# EAGLE design tick-wifi-mk-0.9 (EAGLE 7.5.0)
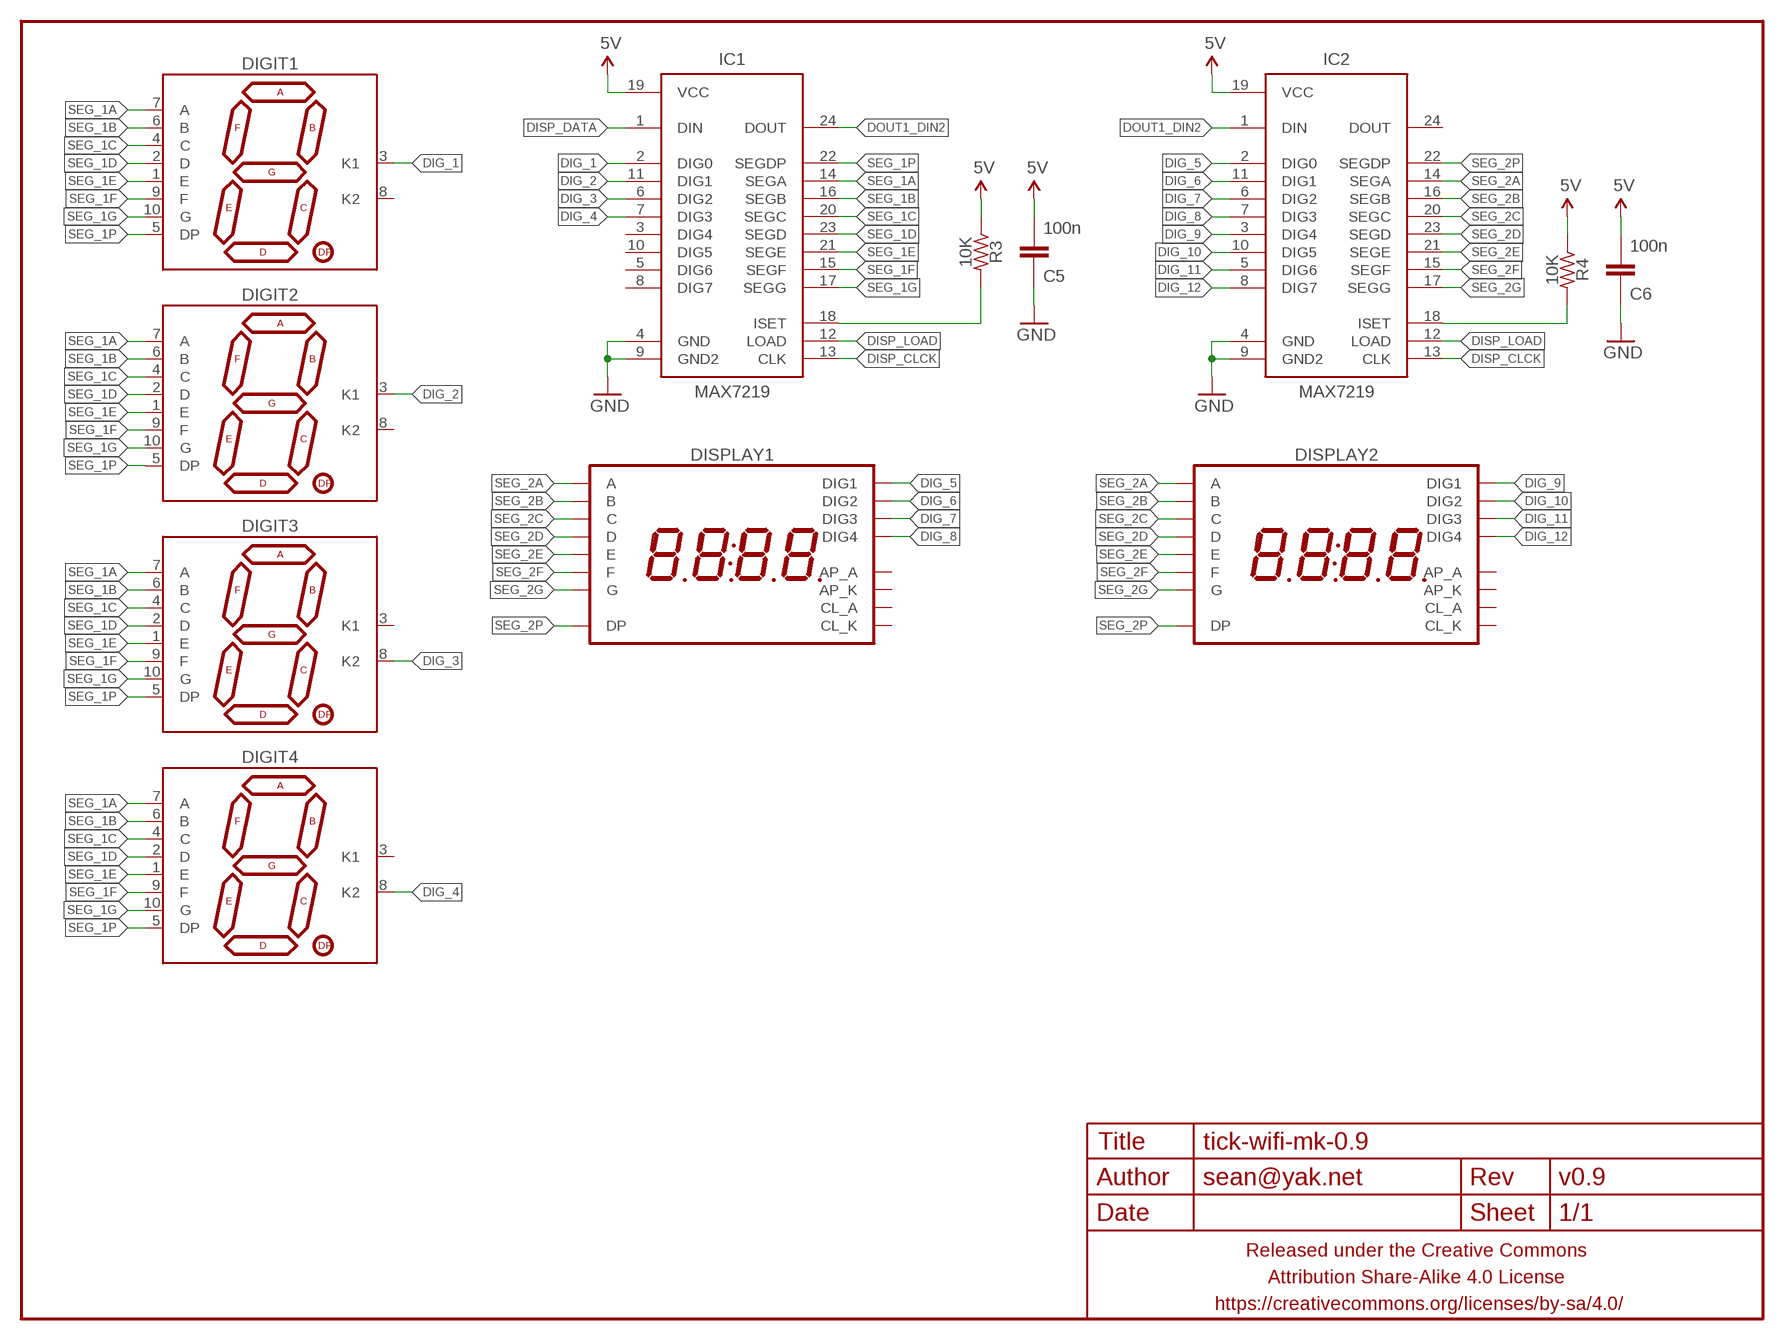
[diagram p0: schematic, sheet 1]

## Parts
C5  100n  CAPACITOR-CERAMICC0603  [C0603]
C6  100n  CAPACITOR-CERAMICC0603  [C0603]
DIGIT1  7SEG_1DIGPTH-25.4MM-BARE  [7SEG_1DIG_25.4MM_NOSILK]
DIGIT2  7SEG_1DIGPTH-25.4MM-BARE  [7SEG_1DIG_25.4MM_NOSILK]
DIGIT3  7SEG_1DIGPTH-25.4MM-BARE  [7SEG_1DIG_25.4MM_NOSILK]
DIGIT4  7SEG_1DIGPTH-25.4MM-BARE  [7SEG_1DIG_25.4MM_NOSILK]
DISPLAY1  7SEG_4DIGIT_COLON_APOS  [7SEG_4DIG_10MM]
DISPLAY2  7SEG_4DIGIT_COLON_APOS  [7SEG_4DIG_10MM]
FRAME1  FRAME-LETTERNO_PACKAGE  [DUMMY]
IC1  MAX7219  MAX7219SOIC-W  [SO24W]
IC2  MAX7219  MAX7219SOIC-W  [SO24W]
R3  10K  RESISTORR0603  [R0603]
R4  10K  RESISTORR0603  [R0603]

## Nets
5V: C5.2 C6.2 IC1.19(VCC) IC2.19(VCC) R3.1 R4.1
DIG_1: DIGIT1.3(K1) IC1.2(DIG0)
DIG_2: DIGIT2.3(K1) IC1.11(DIG1)
DIG_3: DIGIT3.8(K2) IC1.6(DIG2)
DIG_4: DIGIT4.8(K2) IC1.7(DIG3)
DIG_5: DISPLAY1.1(DIG1) IC2.2(DIG0)
DIG_6: DISPLAY1.2(DIG2) IC2.11(DIG1)
DIG_7: DISPLAY1.6(DIG3) IC2.6(DIG2)
DIG_8: DISPLAY1.8(DIG4) IC2.7(DIG3)
DIG_9: DISPLAY2.1(DIG1) IC2.3(DIG4)
DIG_10: DISPLAY2.2(DIG2) IC2.10(DIG5)
DIG_11: DISPLAY2.6(DIG3) IC2.5(DIG6)
DIG_12: DISPLAY2.8(DIG4) IC2.8(DIG7)
DISP_CLCK: IC1.13(CLK) IC2.13(CLK)
DISP_DATA: IC1.1(DIN)
DISP_LOAD: IC1.12(LOAD) IC2.12(LOAD)
DOUT1_DIN2: IC1.24(DOUT) IC2.1(DIN)
GND: C5.1 C6.1 IC1.4(GND) IC1.9(GND2) IC2.4(GND) IC2.9(GND2)
N$2: IC2.18(ISET) R4.2
N$4: IC1.18(ISET) R3.2
SEG_1A: DIGIT1.7(A) DIGIT2.7(A) DIGIT3.7(A) DIGIT4.7(A) IC1.14(SEGA)
SEG_1B: DIGIT1.6(B) DIGIT2.6(B) DIGIT3.6(B) DIGIT4.6(B) IC1.16(SEGB)
SEG_1C: DIGIT1.4(C) DIGIT2.4(C) DIGIT3.4(C) DIGIT4.4(C) IC1.20(SEGC)
SEG_1D: DIGIT1.2(D) DIGIT2.2(D) DIGIT3.2(D) DIGIT4.2(D) IC1.23(SEGD)
SEG_1E: DIGIT1.1(E) DIGIT2.1(E) DIGIT3.1(E) DIGIT4.1(E) IC1.21(SEGE)
SEG_1F: DIGIT1.9(F) DIGIT2.9(F) DIGIT3.9(F) DIGIT4.9(F) IC1.15(SEGF)
SEG_1G: DIGIT1.10(G) DIGIT2.10(G) DIGIT3.10(G) DIGIT4.10(G) IC1.17(SEGG)
SEG_1P: DIGIT1.5(DP) DIGIT2.5(DP) DIGIT3.5(DP) DIGIT4.5(DP) IC1.22(SEGDP)
SEG_2A: DISPLAY1.14(A) DISPLAY2.14(A) IC2.14(SEGA)
SEG_2B: DISPLAY1.16(B) DISPLAY2.16(B) IC2.16(SEGB)
SEG_2C: DISPLAY1.13(C) DISPLAY2.13(C) IC2.20(SEGC)
SEG_2D: DISPLAY1.3(D) DISPLAY2.3(D) IC2.23(SEGD)
SEG_2E: DISPLAY1.5(E) DISPLAY2.5(E) IC2.21(SEGE)
SEG_2F: DISPLAY1.11(F) DISPLAY2.11(F) IC2.15(SEGF)
SEG_2G: DISPLAY1.15(G) DISPLAY2.15(G) IC2.17(SEGG)
SEG_2P: DISPLAY1.7(DP) DISPLAY2.7(DP) IC2.22(SEGDP)
Unconnected: DIGIT1.8(K2) DIGIT2.8(K2) DIGIT3.3(K1) DIGIT4.3(K1) DISPLAY1.4(CL_A) DISPLAY1.9(AP_K) DISPLAY1.10(AP_A) DISPLAY1.12(CL_K) DISPLAY2.4(CL_A) DISPLAY2.9(AP_K) DISPLAY2.10(AP_A) DISPLAY2.12(CL_K) IC1.3(DIG4) IC1.5(DIG6) IC1.8(DIG7) IC1.10(DIG5) IC2.24(DOUT)

## Library data of the parts
C5 C6 = a_parts:CAPACITOR-CERAMIC: CAPACITOR, European symbol
DIGIT1-DIGIT4 = a_parts:7SEG_1DIG
DISPLAY1 DISPLAY2 = a_parts:7SEG_4DIGIT_COLON_APOS
FRAME1 = a_parts:FRAME-LETTER: Schematic Frame Standard 8.5x11 US Letter frame; DESIGNER: sean@yak.net; VERSION: v0.9
IC1 IC2 = a_parts:MAX7219: 8-digit, 8-segment LED display driver, serial input
R3 R4 = a_parts:RESISTOR: RESISTOR, American symbol

## Board
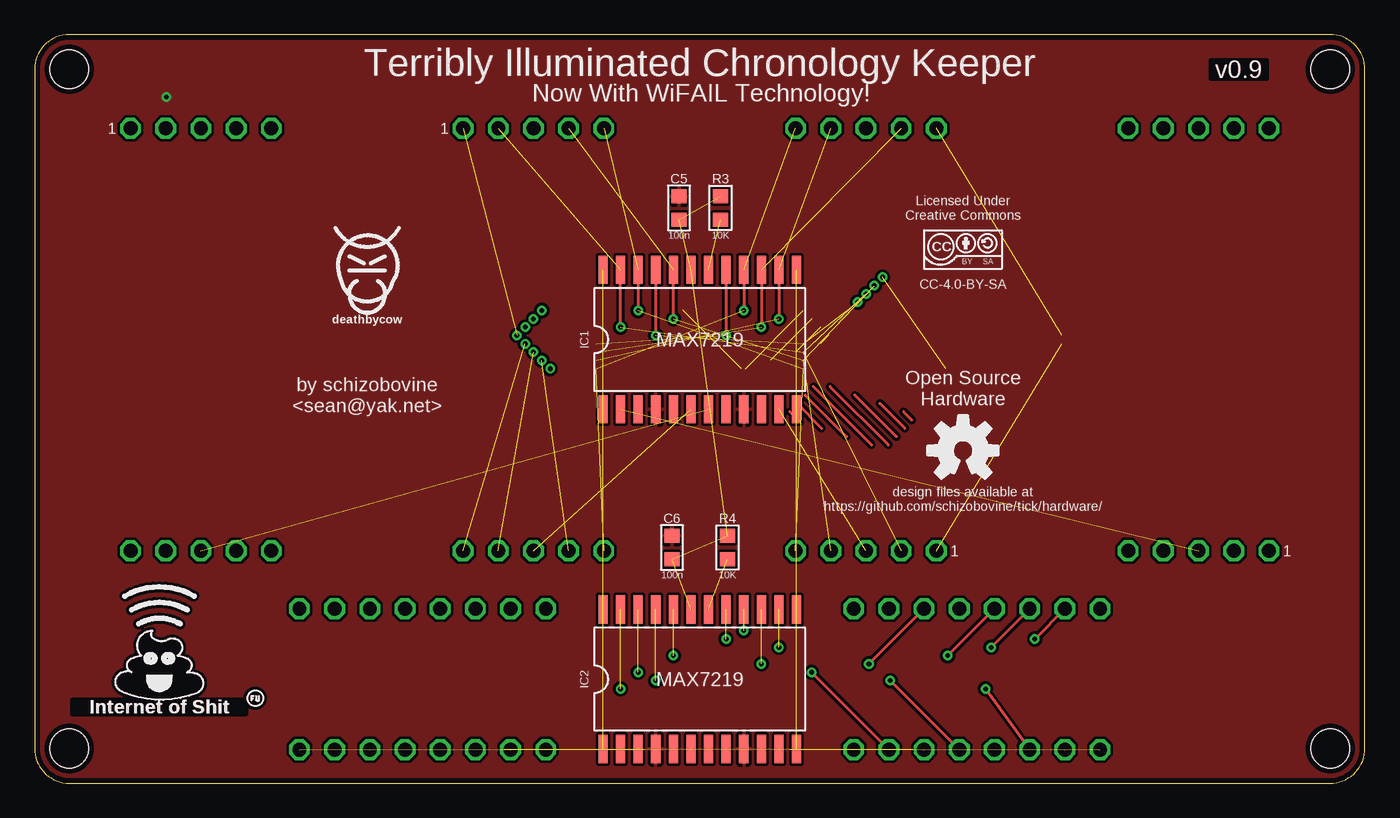
[diagram p1: board, top side]
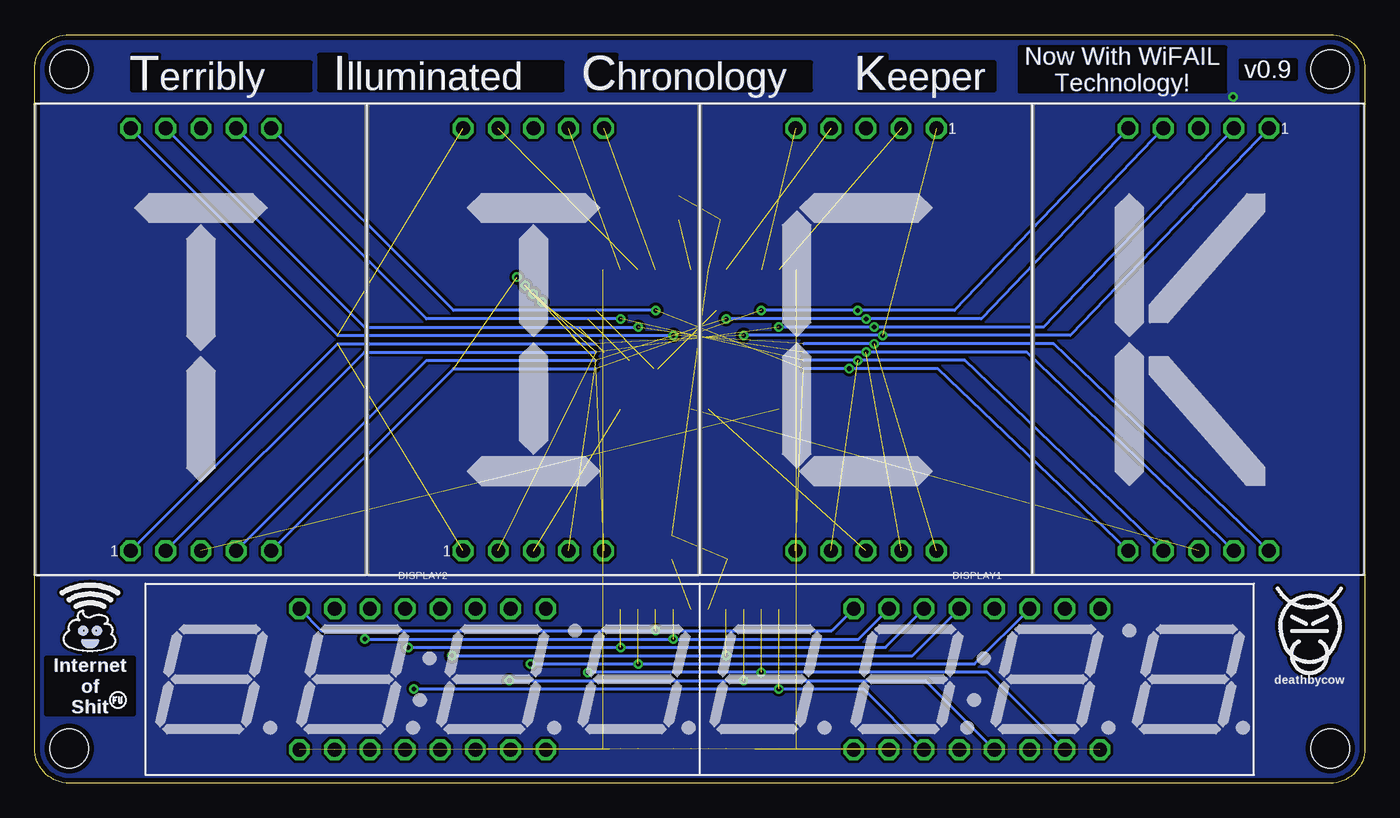
[diagram p2: board, bottom side, seen from below]

Size 96 x 54 mm. Coordinates in mm from the lower left corner, seen from the top.
Outline: 2.5,0 93.5,0 arc90 96,2.5 96,51.5 arc90 93.5,54 2.5,54 arc90 0,51.5 0,2.5 arc90 2.5,0
Copper layers (1*16): Top 0.0356mm / dielectric 1.5011mm / Bottom 0.0356mm
Design rules "LaenPCBOrder_2": minimum track width 6mil, minimum drill 13mil, track to track 6mil, track to pad 6mil, pad to pad 6mil, via to via 6mil, smd to smd 6mil, copper to edge 15mil, drill to drill 6mil, minimum pad ring 7mil, minimum via ring 7mil, stop-mask expansion 3mil, vias tented up to drill 20mil, thermal gap 10mil
Holes 2.8 mm at 2.5,2.5 93.5,2.5 2.5,51.5 93.5,51.5

### Footprints (pad centres in the part's own frame; a part is rotated, then mirrored left to right if it is on the bottom)
C0603 = smd 1 x 1.1: 1 -0.85,0; 2 0.85,0
7SEG_1DIG_25.4MM_NOSILK = drill 1 pad 1.5 octagon: 1 -5.08,-15.24; 2 -2.54,-15.24; 3 0,-15.24; 4 2.54,-15.24; 5 5.08,-15.24; 6 5.08,15.24; 7 2.54,15.24; 8 0,15.24; 9 -2.54,15.24; 10 -5.08,15.24
7SEG_4DIG_10MM = drill 1 octagon: 1 -8.89,-5.08; 2 -6.35,-5.08; 3 -3.81,-5.08; 4 -1.27,-5.08; 5 1.27,-5.08; 6 3.81,-5.08; 7 6.35,-5.08; 8 8.89,-5.08; 9 8.89,5.08; 10 6.35,5.08; 11 3.81,5.08; 12 1.27,5.08; 13 -1.27,5.08; 14 -3.81,5.08; 15 -6.35,5.08; 16 -8.89,5.08
SO24W = smd 0.66 x 2.032: 1 -6.985,-5.029; 2 -5.715,-5.029; 3 -4.445,-5.029; 4 -3.175,-5.029; 5 -1.905,-5.029; 6 -0.635,-5.029; 7 0.635,-5.029; 8 1.905,-5.029; 9 3.175,-5.029; 10 4.445,-5.029; 11 5.715,-5.029; 12 6.985,-5.029; 13 6.985,5.029; 14 5.715,5.029; 15 4.445,5.029; 16 3.175,5.029; 17 1.905,5.029; 18 0.635,5.029; 19 -0.635,5.029; 20 -1.905,5.029; 21 -3.175,5.029; 22 -4.445,5.029; 23 -5.715,5.029; 24 -6.985,5.029
R0603 = smd 1 x 1.1: 1 -0.85,0; 2 0.85,0

### Placement (x,y rotation side)
C5  46.5,41.5 270 top
C6  46,17 270 top
DIGIT1  84,32 0 bottom
DIGIT2  60,32 0 bottom
DIGIT3  36,32 180 bottom
DIGIT4  12,32 180 bottom
DISPLAY1  28,7.5 0 bottom
DISPLAY2  68,7.5 0 bottom
FRAME1  0,-0.5 0 top
IC1  48,32 0 top
IC2  48,7.5 0 top
R3  49.5,41.5 270 top
R4  50,17 270 top
U$1  [TICK_SYMBOL]  48,32 0 bottom
U$2  [COW_SMALL]  24,37.5 0 top
U$3  [INTERNET_OF_SHIT_TEXT_METAL]  9,8.5 0 top
U$4  [INTERNET_OF_SHIT_TEXT]  9,8.5 0 top
U$5  [COW_SMALL]  4,11.5 0 bottom
U$6  [CC-BY-SA-4.0-NO-URL]  67,38.5 0 top
U$7  [OSHWLOGO_SILKONLY]  67,24 0 top
U$8  [INTERNET_OF_SHIT_JR_METAL]  92,11 0 bottom
U$9  [COW_SMALL_METAL_NOTEXT]  4,11.5 0 bottom
U$10  [F_YOU_MARK_METAL]  90,6 0 bottom

### Tracks (layer width: path | path; a pad name or v marks a point on that pad's centre or on a via)
5V  (5 unrouted)
DIG_1  (1 unrouted)
DIG_2  (1 unrouted)
DIG_3  (1 unrouted)
DIG_4  (1 unrouted)
DIG_5  (1 unrouted)
DIG_6  (1 unrouted)
DIG_7  (1 unrouted)
DIG_8  (1 unrouted)
DIG_9  (1 unrouted)
DIG_10  (1 unrouted)
DIG_11  (1 unrouted)
DIG_12  (1 unrouted)
DISP_CLCK  (1 unrouted)
DISP_LOAD  (1 unrouted)
DOUT1_DIN2  (1 unrouted)
GND  (via drill 0.33)
  other vias: 9.5,49.5
  pour Top (isolate 0.2): 2.5,54 93.5,54 arc-90 96,51.5 96,2.5 arc-90 93.5,0 2.5,0 arc-90 0,2.5 0,51.5 arc-90
  pour Bottom (isolate 0.2): 2.5,54 93.5,54 arc-90 96,51.5 96,2.5 arc-90 93.5,0 2.5,0 arc-90 0,2.5 0,51.5 arc-90
  pour Bottom: 6,49 90,49 90,54 6,54
N$1  (2 unrouted)
  Top 0.2: 61.6,24.4 57.4,28.6
N$2  (1 unrouted)
N$3  (1 unrouted)
  Top 0.2: 59.2,28 62.2,25
N$4  (1 unrouted)
N$5  (1 unrouted)
  Top 0.2: 61,27.4 62.8,25.6
N$6  (1 unrouted)
  Top 0.2: 62.7,26.8 63.3,26.2
N$7
  Top 0.2: 56.2,28.6 60.4,24.4
N$8
  Top 0.2: 58.6,25 55.6,28
N$9
  Top 0.2: 56.8,25.6 55,27.4
N$10
  Top 0.2: 55.1,26.2 54.5,26.8
SEG_1A  (via drill 0.33)  (3 unrouted)
  Top 0.2: IC1.14 v53.72,33.5
  Bottom 0.2: 40.5,30.5 v36.6,30.5 28.88,30.5 DIGIT4.7 | DIGIT1.7 67.72,33.5 v53.72,33.5
SEG_1B  (via drill 0.33)  (3 unrouted)
  Top 0.2: IC1.16 v51.17,34.1
  Bottom 0.2: 40.5,29.9 v37.2,29.9 30.82,29.9 DIGIT4.6 | DIGIT1.6 65.78,34.1 v51.17,34.1
SEG_1C  (via drill 0.33)  (4 unrouted)
  Top 0.2: v46.09,33.5 IC1.20
  Bottom 0.2: DIGIT4.4 27.68,33.5 v36,33.5 v46.09,33.5 | DIGIT1.4 67.72,30.5 55.5,30.5
  other vias: 60.6,35.9
SEG_1D  (via drill 0.33)  (4 unrouted)
  Top 0.2: v42.28,32.9 IC1.23
  Bottom 0.2: DIGIT4.2 23.2,32.9 v35.4,32.9 v42.28,32.9 | DIGIT1.2 72.2,31.1 55.5,31.1
  other vias: 60,35.3
SEG_1E  (via drill 0.33)  (4 unrouted)
  Top 0.2: IC1.21 v44.83,32.3
  Bottom 0.2: DIGIT4.1 21.26,32.3 v34.8,32.3 v44.83,32.3 | DIGIT1.1 74.14,31.7 55.5,31.7
  other vias: 59.4,34.7
SEG_1F  (via drill 0.33)  (3 unrouted)
  Top 0.2: IC1.15 v52.45,32.9
  Bottom 0.2: DIGIT4.9 24.4,31.1 v36,31.1 40.5,31.1 | DIGIT1.9 72.2,32.9 v52.45,32.9
SEG_1G  (via drill 0.33)  (3 unrouted)
  Top 0.2: IC1.17 v49.91,32.3
  Bottom 0.2: DIGIT4.10 22.46,31.7 v35.4,31.7 40.5,31.7 | DIGIT1.10 74.14,32.3 v49.91,32.3
SEG_1P  (via drill 0.33)  (4 unrouted)
  Top 0.2: IC1.22 v43.55,34.1
  Bottom 0.2: DIGIT4.5 29.62,34.1 v36.6,34.1 v43.55,34.1 | DIGIT1.5 65.78,29.9 55.5,29.9
  other vias: 61.2,36.5
SEG_2A  (via drill 0.33)  (1 unrouted)
  Top 0.2: DISPLAY2.14 v69.03,9.8
  Bottom 0.2: DISPLAY1.14 34.59,9.8 v53.72,9.8 v69.03,9.8
SEG_2B  (via drill 0.33)  (1 unrouted)
  Bottom 0.2: DISPLAY1.16 38.47,11 v51.17,11 75.31,11 DISPLAY2.16
SEG_2C  (via drill 0.33)  (1 unrouted)
  Top 0.2: DISPLAY2.13 v65.89,9.2
  Bottom 0.2: DISPLAY1.13 32.65,9.2 v46.09,9.2 v65.89,9.2
SEG_2D  (via drill 0.33)  (1 unrouted)
  Top 0.2: DISPLAY2.3 v68.63,6.8
  Bottom 0.2: DISPLAY1.3 36.19,6.8 v42.28,6.8 v68.63,6.8
SEG_2E  (via drill 0.33)  (1 unrouted)
  Top 0.2: DISPLAY2.5 v61.75,7.4
  Bottom 0.2: DISPLAY1.5 31.71,7.4 v44.83,7.4 v61.75,7.4
SEG_2F  (via drill 0.33)  (1 unrouted)
  Top 0.2: DISPLAY2.11 v60.21,8.6
  Bottom 0.2: DISPLAY1.11 28.17,8.6 v52.45,8.6 v60.21,8.6
SEG_2G  (via drill 0.33)  (1 unrouted)
  Top 0.2: DISPLAY2.15 v72.17,10.4
  Bottom 0.2: DISPLAY1.15 36.53,10.4 v49.91,10.4 v72.17,10.4
SEG_2P  (via drill 0.33)  (1 unrouted)
  Top 0.2: DISPLAY2.7 v56.07,8
  Bottom 0.2: DISPLAY1.7 27.23,8 v43.55,8 v56.07,8

### Text on the board
Bottom: Now With WiFAIL / Technology! | K | eeper | C | hronology | I | lluminated | T | erribly | Internet / of / Shit
tPlace: Terribly Illuminated Chronology Keeper | Now With WiFAIL Technology! | Licensed Under / Creative Commons | CC-4.0-BY-SA | by schizobovine / <sean@yak.net> | Open Source / Hardware | design files available at / https://github.com/schizobovine/tick/hardware/
bPlace: Now With WiFAIL / Technology! | K | eeper | C | hronology | I | lluminated | T | erribly | Internet / of / Shit